# EAGLE design 130816_I_T_V_AriloRX_0_0 (EAGLE 6.1)
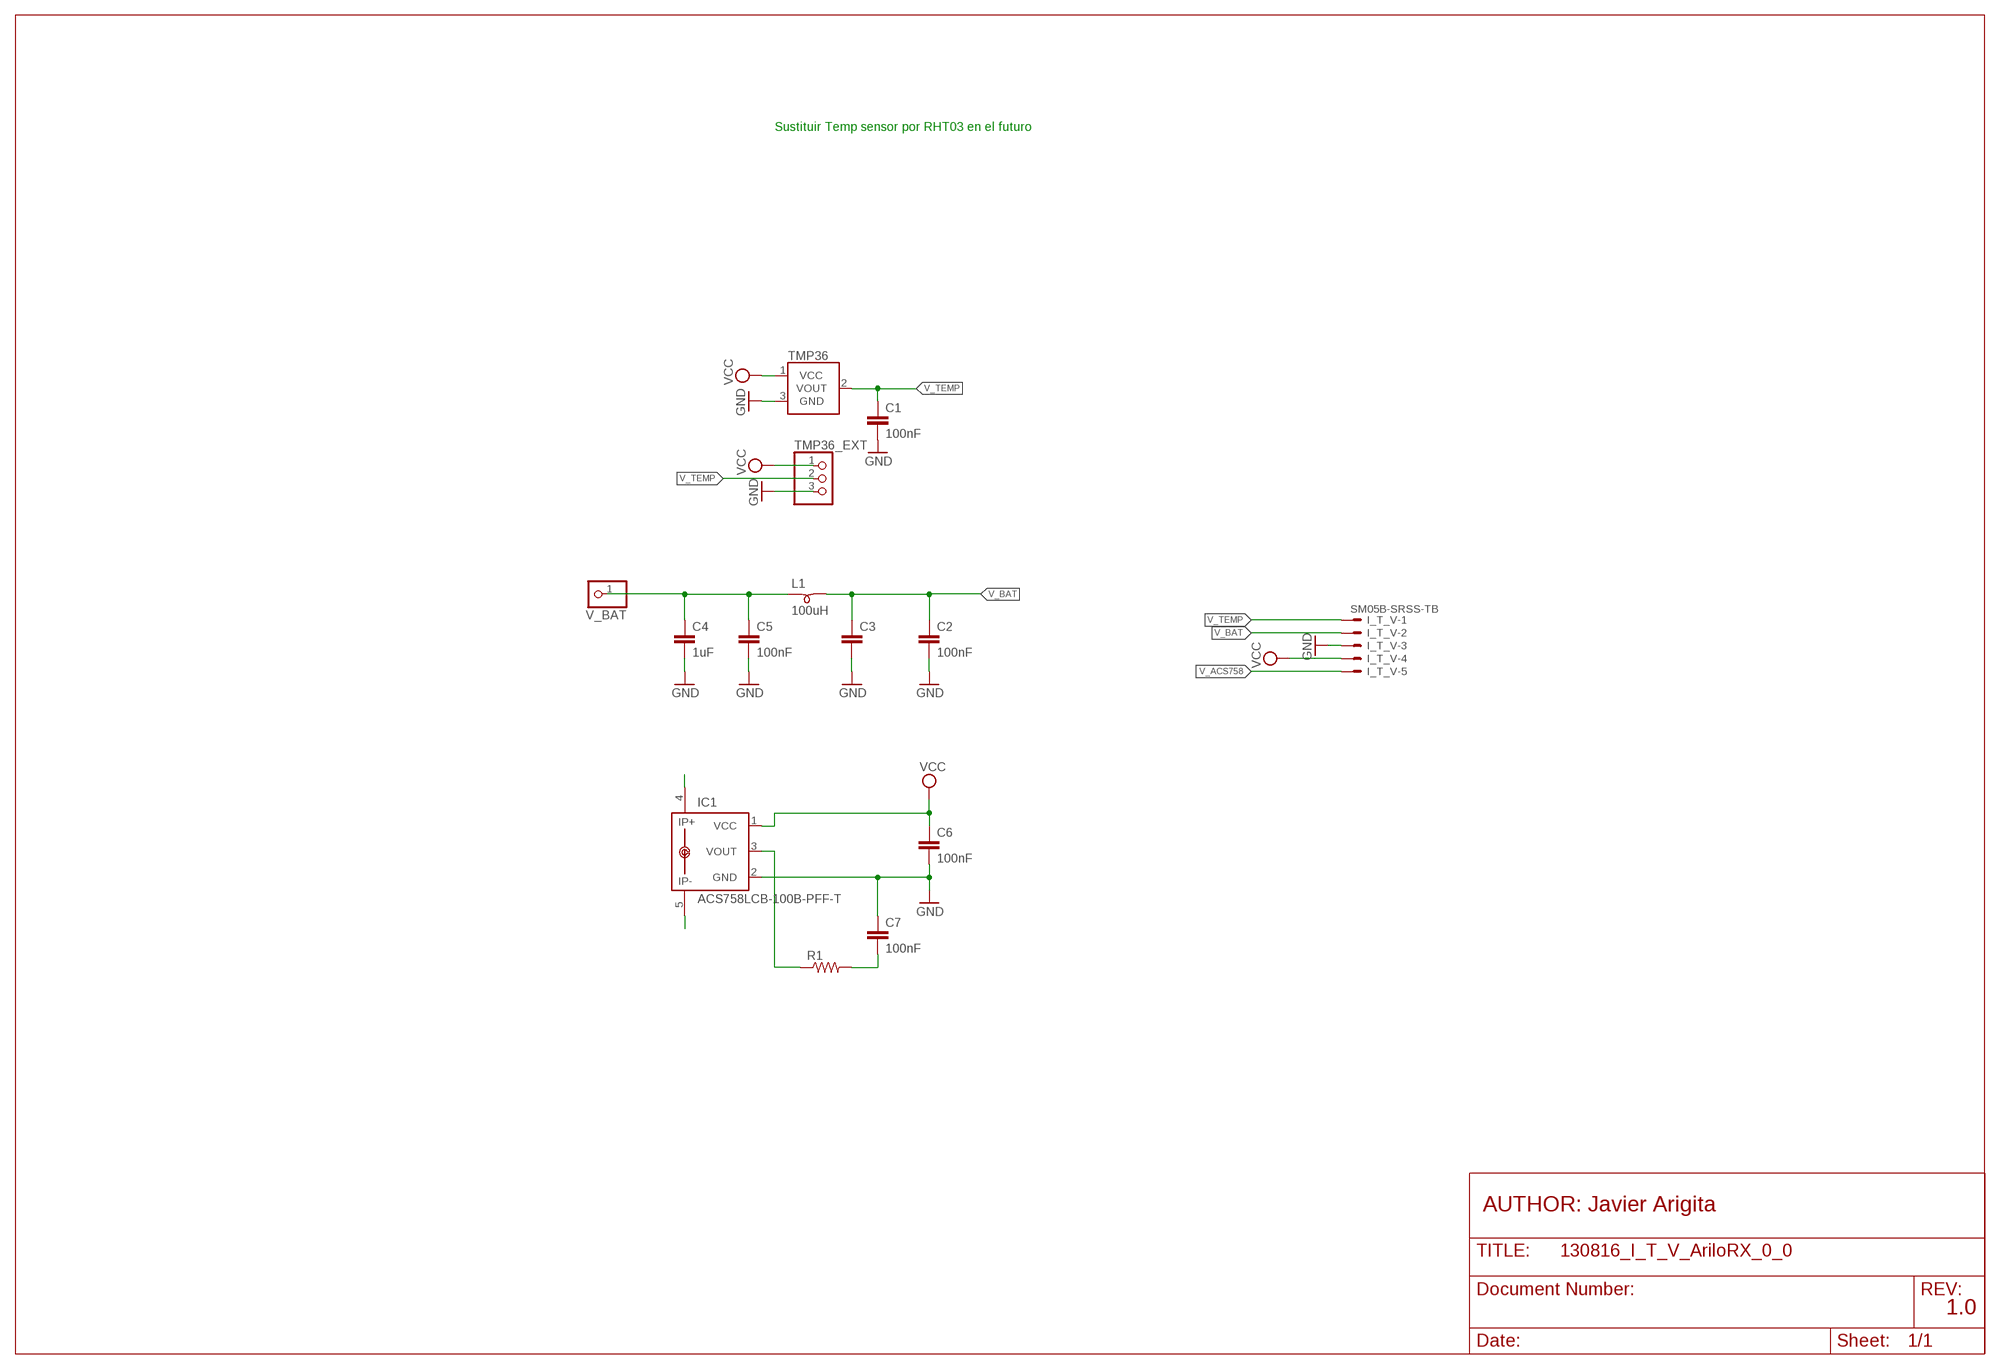
[diagram p0: schematic, sheet 1]

## Parts
C1  100nF  C-EUC0805  [C0805]
C2  100nF  C-EUC0805  [C0805]
C3  C-EUC3216  [C3216]
C4  1uF  C-EUC3216  [C3216]
C5  100nF  C-EUC0805  [C0805]
C6  100nF  C-EUC0805  [C0805]
C7  100nF  C-EUC0805  [C0805]
I_T_V  SM05B-SRSS-TB  [SM05B-SRSS-TB]
IC1  ACS758LCB-100B-PFF-T  [CB-PFF]
L1  100uH  SM-B5  [SM-B5]
R1  RESISTOR0805  [R0805]
TMP36  TMP36GT9  [TO-92]
TMP36_EXT  PINHD-1X3  [1X03]
V_BAT  PINHD-1X1  [1X01]

## Nets
GND: C1.2 C2.2 C3.2 C4.2 C5.2 C6.2 C7.1 I_T_V.3 IC1.2(GND) TMP36.3(GND) TMP36_EXT.3
N$1: C4.1 C5.1 L1.1 V_BAT.1
N$2: IC1.4(IP+)
N$3: IC1.5(IP-)
N$4: C7.2 R1.2
N$5: IC1.3(VOUT) R1.1
V_ACS758: I_T_V.5
V_BAT: C2.1 C3.1 I_T_V.2 L1.2
V_TEMP: C1.1 I_T_V.1 TMP36.2(VOUT) TMP36_EXT.2
VCC: C6.1 I_T_V.4 IC1.1(VCC) TMP36.1(VCC) TMP36_EXT.1
Unconnected: IC1.IP+1 IC1.IP-1

## Notes on the sheet
- Sustituir Temp sensor por RHT03 en el futuro
- AUTHOR: Javier Arigita
- 1.0

## Library data of the parts
C1-C7 = rcl:C-EU: CAPACITOR, European symbol
I_T_V = con-jst2:?M05B-SRSS-TB: Disconnectable Crimp style connector, 1.0mm pitch 5 contacts
IC1 = allegro:ACS758*: Thermally Enhanced, Fully Integrated, Hall Effect-Based Linear Current Sensor with 100 micro Ohm Current Conductor display layer 49 Reference in BRD and place VIAs on circles Source: http://www.allegromicro.com/en/Products/Part_Numbers/0758/0758.pdf; MPN: ACS758LCB-100B-PFF-T; OC_FARNELL: 1718998; OC_NEWARK: 04R7132
L1 = inductor-neosid:SM-B: INDUCTOR SMD Bead inductor; OC_FARNELL: unknown; OC_NEWARK: unknown
R1 = CEDT:RESISTOR
TMP36 = SparkFun-Sensors:TMP36: Precision degC temp sensor, analog out
TMP36_EXT = pinhead:PINHD-1X3: PIN HEADER
V_BAT = pinhead:PINHD-1X1: PIN HEADER

## Board
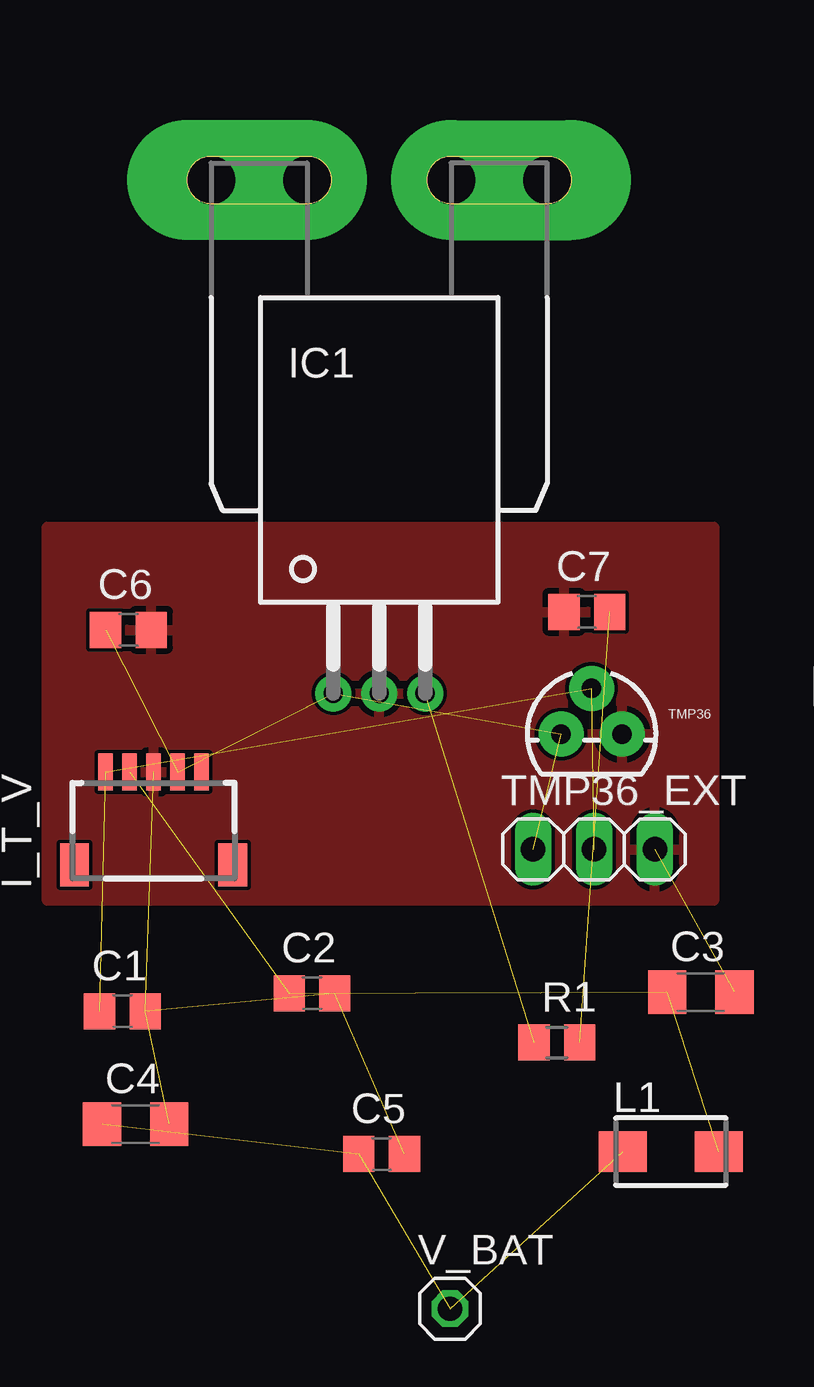
[diagram p1: board, top side]
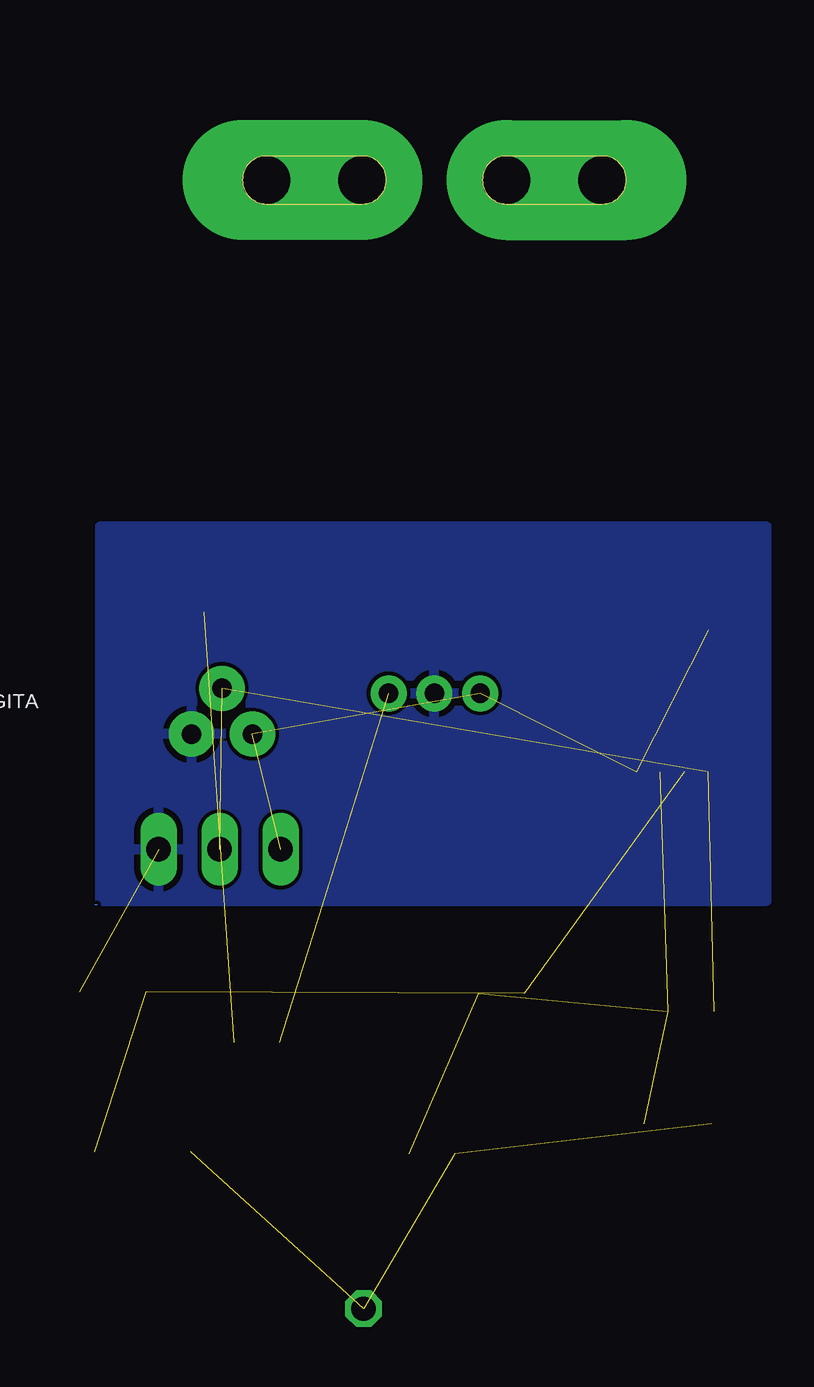
[diagram p2: board, bottom side, seen from below]

No outline drawn. Coordinates in mm, seen from the top.
Copper layers (1*16): Top 0.0356mm / dielectric 1.5011mm / Bottom 0.0356mm
Design rules: minimum track width 6mil, minimum drill 13mil, track to track 6mil, track to pad 6mil, pad to pad 6mil, via to via 6mil, smd to smd 6mil, copper to edge 15mil, drill to drill 6mil, minimum pad ring 7mil, minimum via ring 7mil, stop-mask expansion 4mil, vias tented up to drill 0mil, thermal gap 10mil

### Footprints (pad centres in the part's own frame; a part is rotated, then mirrored left to right if it is on the bottom)
C0805 = smd 1.3 x 1.5: 1 -0.95,0; 2 0.95,0
C3216 = smd 1.6 x 1.8: 1 -1.4,0; 2 1.4,0
SM05B-SRSS-TB = smd 0.6 x 1.55: 1 -2,2.975; 2 -1,2.975; 3 0,2.975; 4 1,2.975; 5 2,2.975 | smd 1.2 x 1.8: FIT@1 -3.3,-0.9; FIT@2 3.3,-0.9
CB-PFF = drill 0.8 pad 1.5: 1 -1.91,-21.4; 2 0,-21.4; 3 1.91,-21.4 | drill 2 pad 5 offset: 4 3,0; 5 -3,0 | drill 2 pad 4 offset: IP+1 7,0; IP-1 -7,0
SM-B5 = smd 2 x 1.7: 1 -2,0; 2 2,0
R0805 = smd 1.3 x 1.5: 1 -0.95,0; 2 0.95,0
TO-92 = drill 0.813 pad 1.88: 1 -1.27,0; 2 0,1.905; 3 1.27,0
1X03 = drill 1.016 long: 1 -2.54,0; 2 0,0; 3 2.54,0
1X01 = drill 1.016 octagon: 1 0,0

### Placement (x,y rotation side)
C1  3.35,-4.4 0 top
C2  11.25,-3.65 0 top
C3  27.45,-3.6 0 top
C4  3.9,-9.1 0 top
C5  14.15,-10.35 0 top
C6  3.6,11.5 0 top
C7  22.7,12.25 0 top
I_T_V  4.65,2.6 0 top
IC1  14.05,30.25 0 top
L1  26.2,-10.25 0 top
R1  21.45,-5.7 0 top
TMP36  22.9,7.15 0 top
TMP36_EXT  23,2.35 0 top
V_BAT  17,-16.8 0 top

### Tracks (layer width: path | path; a pad name or v marks a point on that pad's centre or on a via)
GND  (5 unrouted)
  pour Top: 28,0.2 0.2,0.2 0.2,15.8 28,15.8
  pour Bottom: 28,0.2 0.2,0.2 0.2,15.8 28,15.8
N$1  (3 unrouted)
N$4  (1 unrouted)
N$5  (1 unrouted)
N$7
  Bottom 0: 28.2,0.05 28.1,0.05
V_BAT  (3 unrouted)
V_TEMP  (3 unrouted)
VCC  (4 unrouted)

### Text on the board
bPlace: AriloTX | (c) J.ARIGITA